# EAGLE design XBee (EAGLE 5.04)
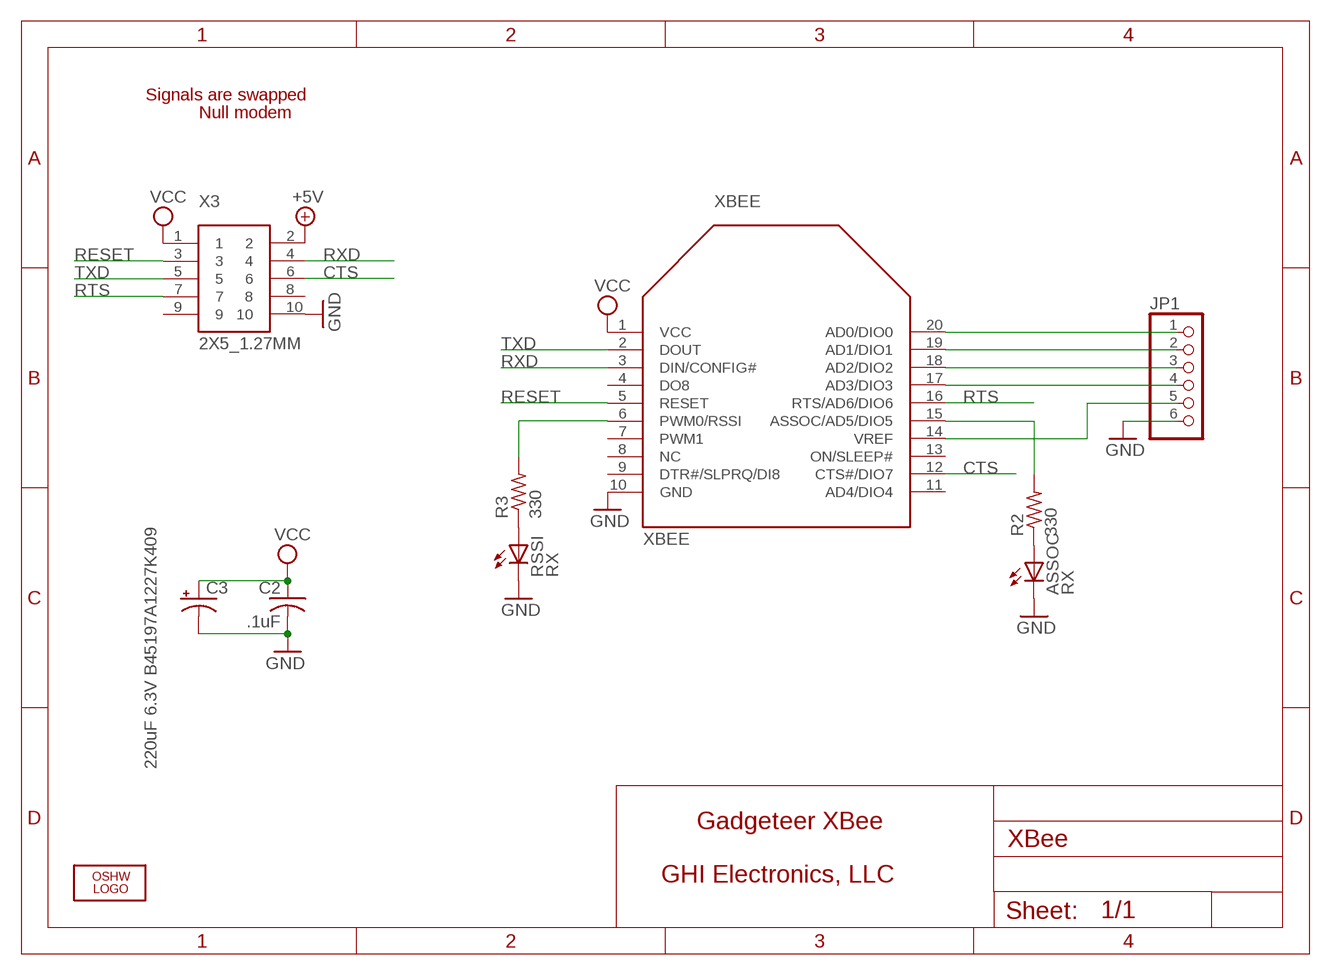
[diagram p0: schematic, sheet 1]

## Parts
ASSOC  RX  LEDCHIPLED_0805  [CHIPLED_0805]
C2  .1uF  C-USC0603K  [C0603K]
C3  220uF 6.3V B45197A1227K409  CPOL-USD/7343-31W  [D/7343-31W]
JP1  PINHD-1X6  [1X06]
LOGO2  LOGO-OSHW-FILLX0200-NT  [OSHW_FILLX200_NOTEXT]
R2  330  R-US_R0603  [R0603]
R3  330  R-US_R0603  [R0603]
RSSI  RX  LEDCHIPLED_0805  [CHIPLED_0805]
X3  2X5_1.27MM  [2X5_1.27MM]
XBEE  XBEE  [XBEE]

## Nets
+5V [power]: X3.2
CTS: X3.6 XBEE.12(CTS#/DIO7)
GND [power]: ASSOC.C C2.2 C3.- JP1.6 RSSI.C X3.10 XBEE.10(GND)
N$1: JP1.5 XBEE.14(VREF)
N$2: ASSOC.A R2.1
N$3: R3.1 RSSI.A
N$4: R3.2 XBEE.6(PWM0/RSSI)
N$5: R2.2 XBEE.15(ASSOC/AD5/DIO5)
N$6: JP1.1 XBEE.20(AD0/DIO0)
N$7: JP1.2 XBEE.19(AD1/DIO1)
N$8: JP1.3 XBEE.18(AD2/DIO2)
N$9: JP1.4 XBEE.17(AD3/DIO3)
RESET: X3.3 XBEE.5(RESET)
RTS: X3.7 XBEE.16(RTS/AD6/DIO6)
RXD: X3.4 XBEE.3(DIN/CONFIG#)
TXD: X3.5 XBEE.2(DOUT)
VCC [power]: C2.1 C3.+ X3.1 XBEE.1(VCC)
Unconnected: X3.8 X3.9 XBEE.4(DO8) XBEE.7(PWM1) XBEE.8(NC) XBEE.9(DTR#/SLPRQ/DI8) XBEE.11(AD4/DIO4) XBEE.13(ON/SLEEP#)

## Notes on the sheet
- Signals are swapped
- Null modem
- Gadgeteer XBee
- GHI Electronics, LLC

## Library data of the parts
ASSOC RSSI = led:LED: LED OSRAM: - CHIPLED LG R971, LG N971, LY N971, LG Q971, LY Q971, LO R971, LY R971 LH N974, LH R974 LS Q976, LO Q976, LY Q976 LO Q996 - Hyper CHIPLED LW Q18S LB Q993, LB Q99A, LB R99A - SideLED LS A670, LO A670, LY A670, LG A670, LP A670 LB A673, LV A673, LT A673, LW A673 LH A674 LY A675 LS A676, LA A676, LO A676, LY A676, LW A676 LS A679, LY A679, LG A679 - Hyper Micro SIDELED® LS Y876, LA Y876, LO Y876, LY Y876 LT Y87S - SmartLED LW L88C, LW L88S LB L89C, LB L89S, LG L890 LS L89K, LO L89K, LY L89K LS L896, LA L896, LO L896, LY L896 - TOPLED LS T670, LO T670, LY T670, LG T670, LP T670 LSG T670, LSP T670, LSY T670, LOP T670, LYG T670 LG T671, LOG T671, LSG T671 LB T673, LV T673, LT T673, LW T673 LH T674 LS T676, LA T676, LO T676, LY T676, LB T676, LH T676, LSB T676, LW T676 LB T67C, LV T67C, LT T67C, LS T67K, LO T67K, LY T67K, LW E67C LS E67B, LA E67B, LO E67B, LY E67B, LB E67C, LV E67C, LT E67C LW T67C LS T679, LY T679, LG T679 LS T770, LO T770, LY T770, LG T770, LP T770 LB T773, LV T773, LT T773, LW T773 LH T774 LS E675, LA E675, LY E675, LS T675 LS T776, LA T776, LO T776, LY T776, LB T776 LHGB T686 LT T68C, LB T68C - Hyper Mini TOPLED® LB M676 - Mini TOPLED Santana® LG M470 LS M47K, LO M47K, LY M47K Source: http://www.osram.convergy.de LUXEON: - LUMILED® LXK2-PW12-R00, LXK2-PW12-S00, LXK2-PW14-U00, LXK2-PW14-V00 LXK2-PM12-R00, LXK2-PM12-S00, LXK2-PM14-U00 LXK2-PE12-Q00, LXK2-PE12-R00, LXK2-PE12-S00, LXK2-PE14-T00, LXK2-PE14-U00 LXK2-PB12-K00, LXK2-PB12-L00, LXK2-PB12-M00, LXK2-PB14-N00, LXK2-PB14-P00, LXK2-PB14-Q00 LXK2-PR12-L00, LXK2-PR12-M00, LXK2-PR14-Q00, LXK2-PR14-R00 LXK2-PD12-Q00, LXK2-PD12-R00, LXK2-PD12-S00 LXK2-PH12-R00, LXK2-PH12-S00 LXK2-PL12-P00, LXK2-PL12-Q00, LXK2-PL12-R00 Source: www.luxeon.com KINGBRIGHT: KA-3528ASYC Source: www.kingbright.com
C2 = rcl:C-US: CAPACITOR, American symbol
C3 = rcl:CPOL-US: POLARIZED CAPACITOR, American symbol
JP1 = pinhead:PINHD-1X6: PIN HEADER
LOGO2 = Logo:LOGO-OSHW-FILL
R2 R3 = rcl:R-US_: RESISTOR, American symbol
X3 = GHI:2X5_1.27MM
XBEE = GHI:XBEE

## Net classes
0 default: width 0.254 mm, drill 0.381 mm, clearance 0.203 mm

## Board
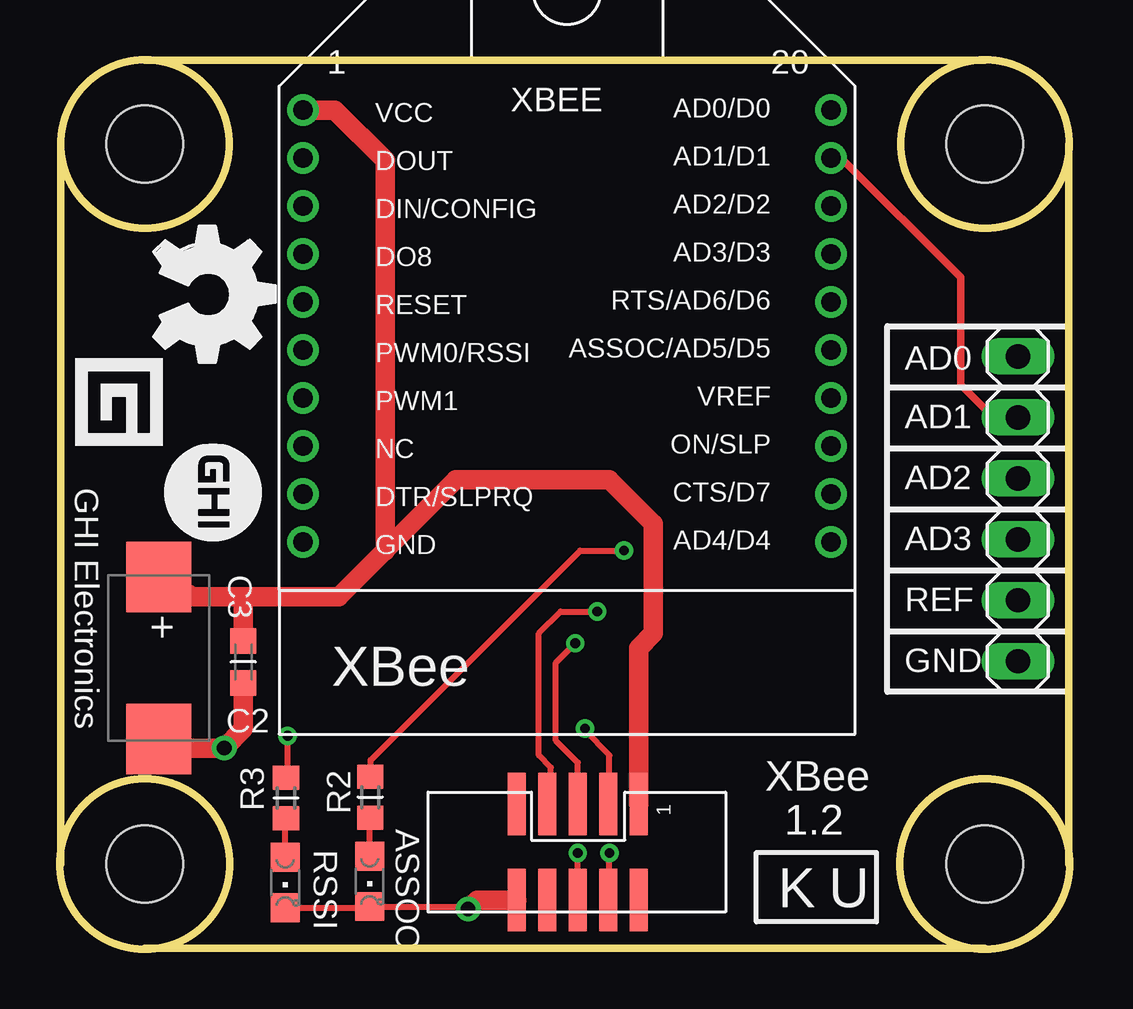
[diagram p1: board, top side]
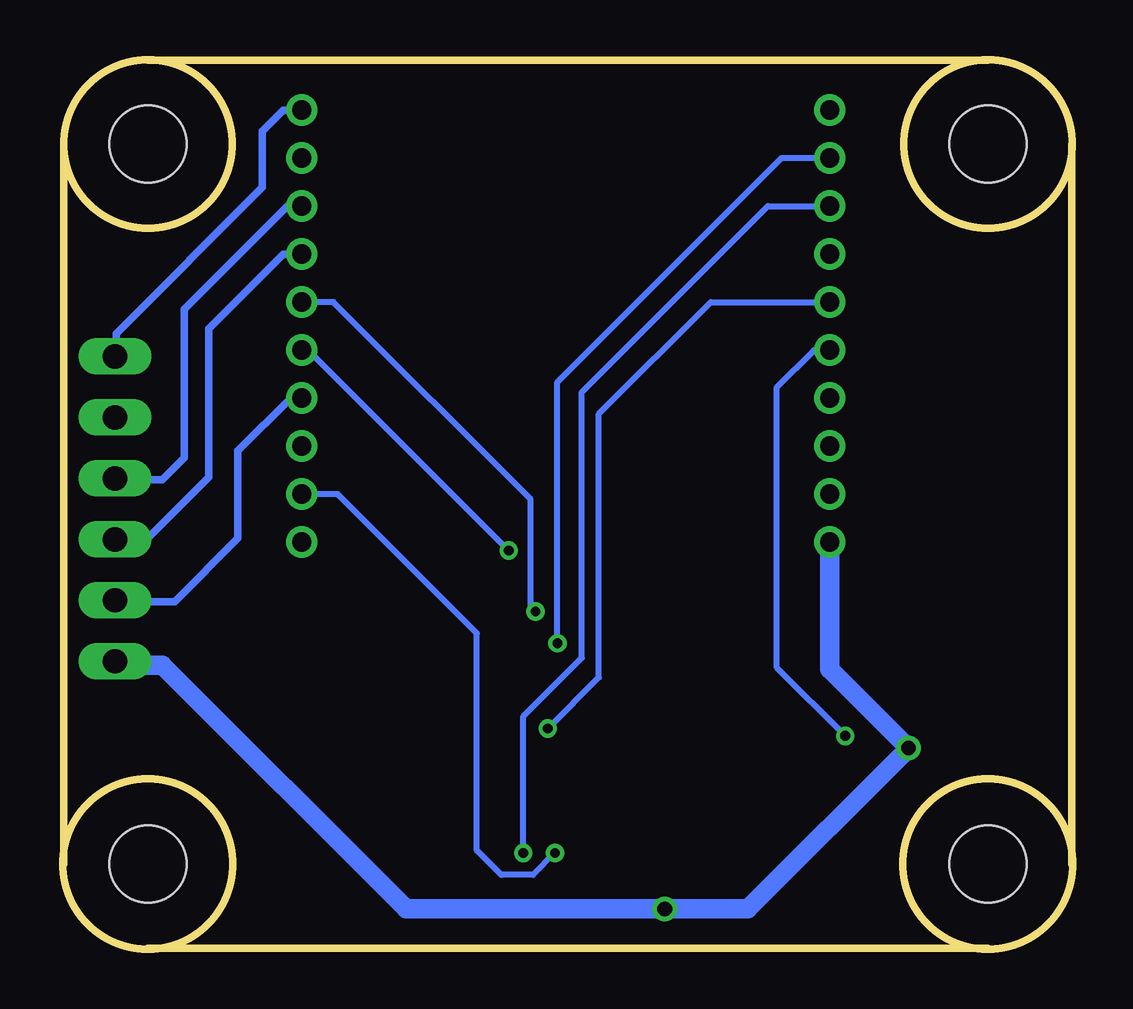
[diagram p2: board, bottom side, seen from below]

Size 42.07 x 37.04 mm. Coordinates in mm from the lower left corner, seen from the top.
Outline: 42.04,3.54 42.04,33.54
Outline: 0.04,33.54 0.04,3.54
Outline: 3.54,37.04 38.54,37.04
Outline: 38.54,0.04 3.54,0.04
Outline: circle at 3.54,33.54 radius 3.5
Outline: circle at 38.54,33.54 radius 3.5
Outline: circle at 38.54,3.54 radius 3.54
Outline: circle at 3.54,3.54 radius 3.54
Copper layers (1+16): Top 0.035mm / dielectric 1.5mm / Bottom 0.035mm
Design rules "default *": minimum track width 8mil, minimum drill 12mil, track to track 8mil, track to pad 8mil, pad to pad 8mil, via to via 8mil, smd to smd 8mil, copper to edge 15mil, drill to drill 8mil, minimum pad ring 10mil, minimum via ring 7mil, stop-mask expansion 4mil, vias tented up to drill 50mil, thermal gap 10mil
Holes 3.2 mm at 3.54,3.54 38.54,33.54 3.54,33.54 38.54,3.54

### Footprints (pad centres in the part's own frame; a part is rotated, then mirrored left to right if it is on the bottom)
CHIPLED_0805 = smd 1.2 x 1.2: A 0,-1.05; C 0,1.05
C0603K = smd 1.05 x 1.08: 1 -0.875,0; 2 0.875,0
D/7343-31W = smd 2.95 x 2.7: + 3.375,0; - -3.375,0
1X06 = drill 1.016 long: 1 -6.35,0; 2 -3.81,0; 3 -1.27,0; 4 1.27,0; 5 3.81,0; 6 6.35,0
R0603 = smd 1 x 1.1: 1 -0.85,0; 2 0.85,0
2X5_1.27MM = smd 2.6 x 0.74: 1 -2,2.58; 2 2,2.58; 3 -2,1.31; 4 2,1.31; 5 -2,0.04; 6 2,0.04; 7 -2,-1.23; 8 2,-1.23; 9 -2,-2.5; 10 2,-2.5
XBEE = drill 0.8 round: 1 -11,8; 2 -11,6; 3 -11,4; 4 -11,2; 5 -11,0; 6 -11,-2; 7 -11,-4; 8 -11,-6; 9 -11,-8; 10 -11,-10; 11 11,-10; 12 11,-8; 13 11,-6; 14 11,-4; 15 11,-2; 16 11,0; 17 11,2; 18 11,4; 19 11,6; 20 11,8

### Placement (x,y rotation side)
ASSOC  12.9,2.81 180 top
C2  7.64,11.95 270 top
C3  4.12,12.12 90 top
JP1  39.91,18.33 270 top
LOGO2  3.9,30.11 270 top
R2  12.93,6.32 90 top
R3  9.42,6.29 90 top
RSSI  9.38,2.77 180 top
X3  21.54,4.04 270 top
XBEE  21.13,26.95 0 top

### Tracks (layer width: path | path; a pad name or v marks a point on that pad's centre or on a via)
CTS  (via drill 0.41)
  Top 0.254: v21.57,4 X3.6
  Bottom 0.254: XBEE.12 30.63,18.95 24.83,13.14 24.83,4.1 23.81,3.08 22.49,3.08 v21.57,4 21.68,3.9
GND  (via drill 0.61)
  Top 0.254: RSSI.C 12.85,1.72 ASSOC.C 16.9,1.76 v17,1.66
  Top 0.813: C3.- 5.11,8.37 v6.84,8.37 7.64,9.17 C2.2 | X3.10 17.38,2.04 v17,1.66
  Bottom 0.813: 39.52,11.98 JP1.6 39.75,11.82 37.93,11.82 27.77,1.66 v17,1.66 13.55,1.66 v6.84,8.37 10.13,11.65 XBEE.10
N$1
  Bottom 0.305: XBEE.14 32.59,22.95 34.78,20.76 34.78,17.1 37.42,14.46 39.85,14.46 JP1.5
N$2
  Top 0.254: ASSOC.A 12.9,5.44 R2.1
N$3
  Top 0.254: RSSI.A 9.38,5.4 R3.1
N$4  (via drill 0.41)
  Top 0.254: v9.48,8.87 9.48,7.2 R3.2
  Bottom 0.254: XBEE.6 10.78,24.95 12.33,23.4 12.33,11.72 v9.48,8.87
N$5  (via drill 0.41)
  Top 0.254: v23.51,16.6 21.68,16.6 12.94,7.86 12.94,7.18 R2.2
  Bottom 0.254: XBEE.15 31.86,24.95 v23.51,16.6
N$6
  Bottom 0.305: XBEE.20 32.89,34.95 33.77,34.07 33.77,31.73 39.86,25.64 39.86,24.73 JP1.1
N$7
  Top 0.305: XBEE.19 32.55,32.95 37.53,27.98 37.53,23.51 38.85,22.18 39.87,22.18 JP1.2
N$8
  Bottom 0.305: XBEE.18 32.72,30.95 37.02,26.65 37.02,20.46 37.93,19.54 39.85,19.54 JP1.3
N$9
  Bottom 0.305: XBEE.17 32.89,28.95 36,25.84 36,19.64 38.54,17.1 39.87,17.1 JP1.4
RESET  (via drill 0.41)
  Top 0.254: v21.88,9.18 21.88,9.08 22.9,8.06 22.9,6.09 X3.3
  Bottom 0.254: XBEE.5 15.08,26.95 19.75,22.29 19.75,11.31 v21.88,9.18
RTS  (via drill 0.41)
  Top 0.254: v22.39,14.06 20.86,14.06 19.95,13.14 19.95,8.06 20.46,7.55 20.46,6.19 X3.7
  Bottom 0.254: XBEE.16 30.81,26.95 22.59,18.73 22.59,14.26 v22.39,14.06
RXD  (via drill 0.41)
  Top 0.254: v22.9,4 22.9,2.09 X3.4
  Bottom 0.254: XBEE.3 12.71,30.95 20.46,23.2 20.46,12.13 22.9,9.69 v22.9,4
TXD  (via drill 0.41)
  Top 0.254: X3.5 21.58,7.76 20.66,8.67 20.66,11.92 v21.47,12.74 v21.47,12.73
  Bottom 0.254: v21.47,12.74 21.47,23.61 12.13,32.95 XBEE.2
VCC
  Top 0.813: X3.1 24.12,12.53 24.72,13.14 24.72,17.71 22.9,19.54 16.49,19.54 13.5,16.55 | 13.5,16.55 11.62,14.67 7.66,14.67 | 7.66,14.67 5.56,14.67 C3.+ | C2.1 7.64,14.65 7.66,14.67 | XBEE.1 11.45,34.95 13.55,32.85 13.55,16.6 13.5,16.55

### Text on the board
tPlace: AD0 | AD1 | GHI Electronics | AD2 | AD3 | REF | GND | XBee | 1.2 | K | U